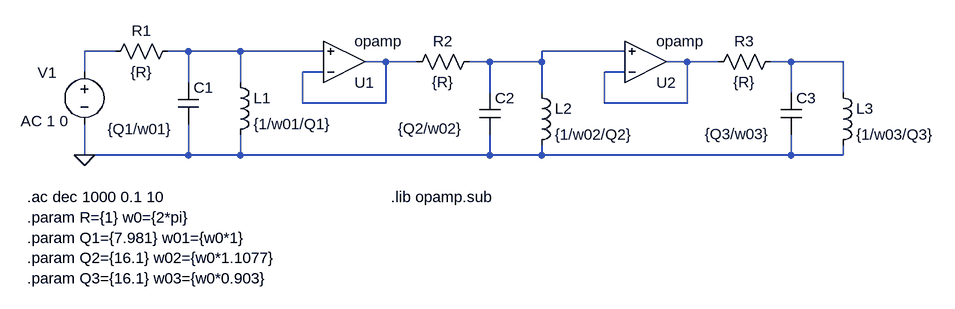
[diagram p0: schematic pasabanda_cheby_pasivo.asc]
pasabanda_cheby_pasivo.asc, the LTspice schematic file:
Version 4
SHEET 1 1348 680
WIRE 32 128 -16 128
WIRE 144 128 112 128
WIRE 224 128 144 128
WIRE 352 128 224 128
WIRE 816 128 688 128
WIRE 448 144 416 144
WIRE 496 144 448 144
WIRE 608 144 576 144
WIRE 688 144 688 128
WIRE 688 144 608 144
WIRE 912 144 880 144
WIRE 960 144 912 144
WIRE 1072 144 1040 144
WIRE 1152 144 1072 144
WIRE -16 160 -16 128
WIRE 352 160 320 160
WIRE 816 160 784 160
WIRE 144 176 144 128
WIRE 224 176 224 128
WIRE 608 192 608 144
WIRE 688 192 688 144
WIRE 1072 192 1072 144
WIRE 1152 192 1152 144
WIRE 320 208 320 160
WIRE 448 208 448 144
WIRE 448 208 320 208
WIRE 784 208 784 160
WIRE 912 208 912 144
WIRE 912 208 784 208
WIRE -16 288 -16 240
WIRE 144 288 144 240
WIRE 144 288 -16 288
WIRE 224 288 224 256
WIRE 224 288 144 288
WIRE 608 288 608 256
WIRE 608 288 224 288
WIRE 688 288 688 272
WIRE 688 288 608 288
WIRE 1072 288 1072 256
WIRE 1072 288 688 288
WIRE 1152 288 1152 272
WIRE 1152 288 1072 288
FLAG -16 288 0
SYMBOL res 128 112 R90
WINDOW 0 0 56 VBottom 2
WINDOW 3 32 56 VTop 2
SYMATTR InstName R1
SYMATTR Value {R}
SYMBOL cap 128 176 R0
WINDOW 3 -108 72 Left 2
SYMATTR Value {Q1/w01}
SYMATTR InstName C1
SYMBOL ind 208 160 R0
SYMATTR InstName L1
SYMATTR Value {1/w01/Q1}
SYMBOL voltage -16 144 R0
WINDOW 0 -72 17 Left 2
WINDOW 123 -98 91 Left 2
WINDOW 39 0 0 Left 0
SYMATTR InstName V1
SYMATTR Value2 AC 1 0
SYMATTR Value ""
SYMBOL OpAmps\\opamp 384 208 M180
SYMATTR InstName U1
SYMBOL res 592 128 R90
WINDOW 0 0 56 VBottom 2
WINDOW 3 32 56 VTop 2
SYMATTR InstName R2
SYMATTR Value {R}
SYMBOL cap 592 192 R0
WINDOW 3 -125 55 Left 2
SYMATTR Value {Q2/w02}
SYMATTR InstName C2
SYMBOL ind 672 176 R0
SYMATTR InstName L2
SYMATTR Value {1/w02/Q2}
SYMBOL OpAmps\\opamp 848 208 M180
SYMATTR InstName U2
SYMBOL res 1056 128 R90
WINDOW 0 0 56 VBottom 2
WINDOW 3 32 56 VTop 2
SYMATTR InstName R3
SYMATTR Value {R}
SYMBOL cap 1056 192 R0
WINDOW 3 -117 63 Left 2
SYMATTR Value {Q3/w03}
SYMATTR InstName C3
SYMBOL ind 1136 176 R0
SYMATTR InstName L3
SYMATTR Value {1/w03/Q3}
TEXT -104 352 Left 2 !.ac dec 1000 0.1 10
TEXT -104 384 Left 2 !.param R={1} w0={2*pi}\n.param Q1={7.981} w01={w0*1}\n.param Q2={16.1} w02={w0*1.1077}\n.param Q3={16.1} w03={w0*0.903}
TEXT 456 352 Left 2 !.lib opamp.sub

The netlist it stands for:
* pasabanda_cheby_pasivo.asc
R1 N002 N001 {R}
C1 N002 0 {Q1/w01}
L1 N002 0 {1/w01/Q1}
V1 N001 0 AC 1 0
XU1 N004 N002 N004 opamp Aol=100K GBW=10Meg  ; pins invin noninvin out
R2 N003 N004 {R}
C2 N003 0 {Q2/w02}
L2 N003 0 {1/w02/Q2}
XU2 N005 N003 N005 opamp Aol=100K GBW=10Meg  ; pins invin noninvin out
R3 N006 N005 {R}
C3 N006 0 {Q3/w03}
L3 N006 0 {1/w03/Q3}
.ac dec 1000 0.1 10
.param R={1} w0={2*pi}
.param Q1={7.981} w01={w0*1}
.param Q2={16.1} w02={w0*1.1077}
.param Q3={16.1} w03={w0*0.903}
.lib opamp.sub
.backanno
.end